# Altium schematic sheet 03-VS1053B.SchDoc: VS1053 and FM receiver
size A3; Date: 01/01/2016; Author: Frédéric Renet; Organization: APTUSTECH; Address2: 8 Rue Esperandieu; Address3: 13004 Marseille; Address4: FRANCE; DocumentNumber: 123; Revision: 1.0; SheetNumber: 4; SheetTotal: 6
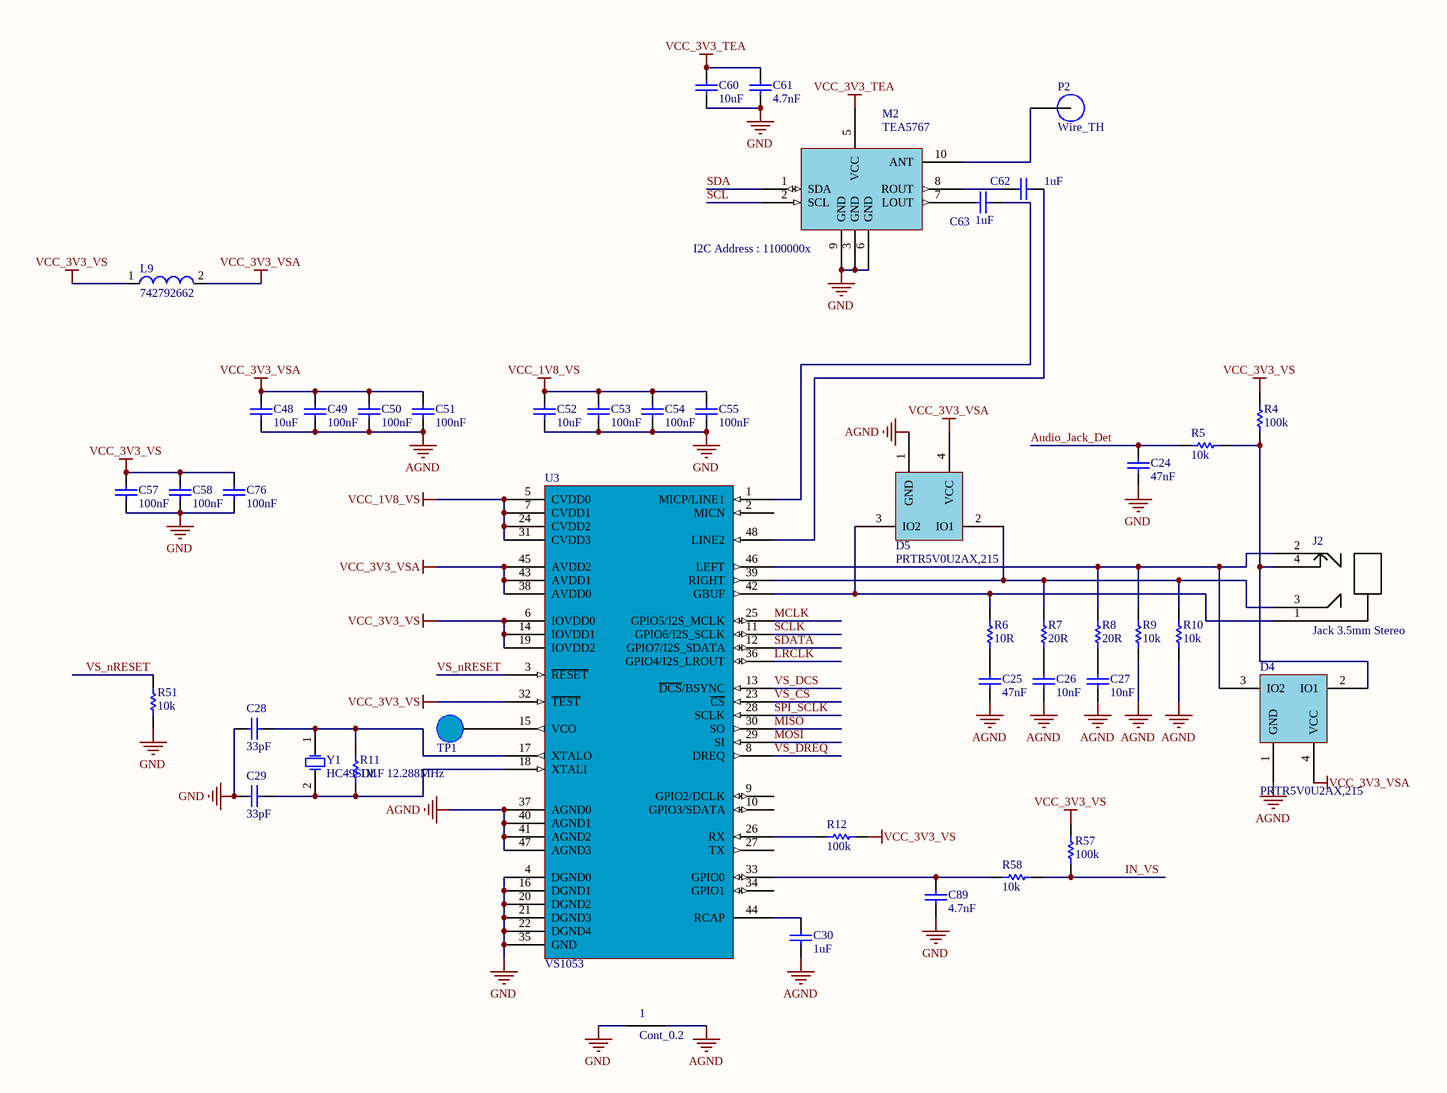
[diagram p0: 03-VS1053B.SchDoc]

## Parts
1  Cont_0.2  [CONT_0.2]  (net tie, no BOM)
C24  value 47nF  [CAPC1608X06N]  (hidden comment: 47nF 50V 0603 X7R)
C25  value 47nF  [CAPC1608X06N]  (hidden comment: 47nF 50V 0603 X7R)
C26  value 10nF  [CAPC1608X06N]  (hidden comment: 10nF 50V 0603 NP0)
C27  value 10nF  [CAPC1608X06N]  (hidden comment: 10nF 50V 0603 NP0)
C28  value 33pF  [CAPC1608X06N]  (hidden comment: 33pF 50V 0603 NP0)
C29  value 33pF  [CAPC1608X06N]  (hidden comment: 33pF 50V 0603 NP0)
C30  value 1uF  [CAPC1608X06N]  (hidden comment: 1uF 16V 0603 X7R)
C48  value 10uF  [CAPC1608X06N]  (hidden comment: 10uF 6.3V 0603 X5R)
C49  value 100nF  [CAPC1608X06N]  (hidden comment: 100nF 25V 0603 X5R)
C50  value 100nF  [CAPC1608X06N]  (hidden comment: 100nF 25V 0603 X5R)
C51  value 100nF  [CAPC1608X06N]  (hidden comment: 100nF 25V 0603 X5R)
C52  value 10uF  [CAPC1608X06N]  (hidden comment: 10uF 6.3V 0603 X5R)
C53  value 100nF  [CAPC1608X06N]  (hidden comment: 100nF 25V 0603 X5R)
C54  value 100nF  [CAPC1608X06N]  (hidden comment: 100nF 25V 0603 X5R)
C55  value 100nF  [CAPC1608X06N]  (hidden comment: 100nF 25V 0603 X5R)
C57  value 100nF  [CAPC1608X06N]  (hidden comment: 100nF 25V 0603 X5R)
C58  value 100nF  [CAPC1608X06N]  (hidden comment: 100nF 25V 0603 X5R)
C60  value 10uF  [CAPC1608X06N]  (hidden comment: 10uF 6.3V 0603 X5R)
C61  value 4.7nF  [CAPC1608X06N]  (hidden comment: 4.7nF 50V 0603 X7R)
C62  value 1uF  [CAPC1608X06N]  (hidden comment: 1uF 16V 0603 X7R)
C63  value 1uF  [CAPC1608X06N]  (hidden comment: 1uF 16V 0603 X7R)
C76  value 100nF  [CAPC1608X06N]  (hidden comment: 100nF 25V 0603 X5R)
C89  value 4.7nF  [CAPC1608X06N]  (hidden comment: 4.7nF 50V 0603 X7R)
D4  PRTR5V0U2AX,215  [SOT190P230X120-4N]
D5  PRTR5V0U2AX,215  [SOT190P230X120-4N]
J2  Jack 3.5mm Stereo  [SJ1-352xng]
L9  742792662  [CAPC0603(1608)]
M2  TEA5767  [MOD_TEA5767]
P2  Wire_TH  [TH_0.8mm]  (no BOM)
R4  value 100k  [RESC1608X06N]  (hidden comment: 100k_0603)
R5  value 10k  [RESC1608X06N]  (hidden comment: 10k_0603)
R6  value 10R  [RESC1608X06N]  (hidden comment: 10R_0603)
R7  value 20R  [RESC1608X06N]  (hidden comment: 20R_0603)
R8  value 20R  [RESC1608X06N]  (hidden comment: 20R_0603)
R9  value 10k  [RESC1608X06N]  (hidden comment: 10k_0603)
R10  value 10k  [RESC1608X06N]  (hidden comment: 10k_0603)
R11  value 1M  [RESC1608X06N]  (hidden comment: 1M_0603)
R12  value 100k  [RESC1608X06N]  (hidden comment: 100k_0603)
R51  value 10k  [RESC1608X06N]  (hidden comment: 10k_0603)
R57  value 100k  [RESC1608X06N]  (hidden comment: 100k_0603)
R58  value 10k  [RESC1608X06N]  (hidden comment: 10k_0603)
TP1  TP_1mm  [TP_1mm]  (value not drawn)  (no BOM)
U3  VS1053  [TSQFP50P900X900X160-48N]
Y1  HC49SDLF 12.288MHz  [TXC 9C]

## Nets
AGND: 1.2 C25.1 C26.1 C27.1 C30.1 C48.1 C49.1 C50.1 C51.1 D4.1(GND) D5.1(GND) R9.2 R10.2 U3.37(AGND0) U3.40(AGND1) U3.41(AGND2) U3.47(AGND3)
GND: 1.1 C24.1 C28.1 C29.1 C52.1 C53.1 C54.1 C55.1 C57.1 C58.1 C60.1 C61.1 C76.1 C89.1 M2.3(GND) M2.6(GND) M2.9(GND) R51.1 U3.4(DGND0) U3.16(DGND1) U3.20(DGND2) U3.21(DGND3) U3.22(DGND4) U3.35(GND)
VCC_1V8_VS: C52.2 C53.2 C54.2 C55.2 U3.5(CVDD0) U3.7(CVDD1) U3.24(CVDD2) U3.31(CVDD3)
VCC_3V3_TEA: C60.2 C61.2 M2.5(VCC)
VCC_3V3_VS: C57.2 C58.2 C76.2 L9.1 R4.2 R12.2 R57.2 U3.6(IOVDD0) U3.14(IOVDD1) U3.19(IOVDD2) U3.32(~{TEST})
VCC_3V3_VSA: C48.2 C49.2 C50.2 C51.2 D4.4(VCC) D5.4(VCC) L9.2 U3.38(AVDD0) U3.43(AVDD1) U3.45(AVDD2)
Audio_Jack_Det: C24.2 R5.1
IN_VS: R57.1 R58.1
LRCLK: U3.36(GPIO4/I2S_LROUT)
MCLK: U3.25(GPIO5/I2S_MCLK)
MISO: U3.30(SO)
MOSI: U3.29(SI)
SCL: M2.2(SCL)
SCLK: U3.11(GPIO6/I2S_SCLK)
SDA: M2.1(SDA)
SDATA: U3.12(GPIO7/I2S_SDATA)
SPI_SCLK: U3.28(SCLK)
VS_CS: U3.23(~{CS})
VS_DCS: U3.13(~{DCS}/BSYNC)
VS_DREQ: U3.8(DREQ)
VS_nRESET: R51.2 U3.3(~{RESET})
NetC25_2: C25.2 R6.1
NetC26_2: C26.2 R7.1
NetC27_2: C27.2 R8.1
NetC28_2: C28.2 R11.2 U3.17(XTALO) Y1.1(OSC1)
NetC29_2: C29.2 R11.1 U3.18(XTALI) Y1.2(OSC2)
NetC30_2: C30.2 U3.44(RCAP)
NetC62_1: C62.1 M2.8(ROUT)
NetC62_2: C62.2 U3.48(LINE2)
NetC63_1: C63.1 M2.7(LOUT)
NetC63_2: C63.2 U3.1(MICP/LINE1)
NetC89_2: C89.2 R58.2 U3.33(GPIO0)
NetD4_2: D4.2(IO1) J2.4 R4.1 R5.2
NetD4_3: D4.3(IO2) J2.2 R8.2 R9.1 U3.46(LEFT)
NetD5_2: D5.2(IO1) J2.3 R7.2 R10.1 U3.39(RIGHT)
NetD5_3: D5.3(IO2) J2.1 R6.2 U3.42(GBUF)
NetM2_10: M2.10(ANT) P2.1
NetR12_1: R12.1 U3.26(RX)
NetTP1_1: TP1.1 U3.15(VCO)

Not connected (* = marked no-connect by the designer): U3 2(MICN) 9(GPIO2/DCLK) 10(GPIO3/SDATA) 27(TX) 34(GPIO1)

## Notes on the sheet
- (near M2) I2C Address : 1100000x
- Title
- Size:
- Date:
- A3
- Number:
- Author:
- Revision:
- Sheet
- of
- File:

## Library data of the parts
1 = Cont_0.2: Split Net Name 0.2mm
C24 C25 = 47nF 50V 0603 X7R: Tolerance: 10%; Voltage: 50V; Supplier1: Digikey; Supplier2: Mouser; Supplier3: Farnell; RefSupplier1: 1276-1063-1-ND; RefSupplier2: *; RefSupplier3: *; Case: 0603; Material: X7R
C26 C27 = 10nF 50V 0603 NP0: Tolerance: 10%; Voltage: 50V; Supplier1: Digikey; Supplier2: Mouser; Supplier3: Farnell; RefSupplier1: 490-9666-1-ND; RefSupplier2: *; RefSupplier3: *; Case: 0603; Material: NP0
C28 C29 = 33pF 50V 0603 NP0: Tolerance: 10%; Voltage: 50V; Supplier1: Digikey; Supplier2: Mouser; Supplier3: Farnell; RefSupplier1: 490-1415-1-ND; RefSupplier2: *; RefSupplier3: *; Case: 0603; Material: NP0
C30 C62 C63 = 1uF 16V 0603 X7R: Tolerance: 10%; Voltage: 16V; Supplier1: Digikey; Supplier2: Mouser; Supplier3: Farnell; RefSupplier1: EMK107B7105KA-T; RefSupplier2: *; RefSupplier3: *; Case: 0603; Material: X7R
C48 C52 C60 = 10uF 6.3V 0603 X5R: Tolerance: 10%; Voltage: 6.3V; Supplier1: Digikey; Supplier2: Mouser; Supplier3: Farnell; RefSupplier1: 587-1256-1-ND; RefSupplier2: *; RefSupplier3: *; Case: 0603; Material: X5R
C49-C51 C53-C55 C57 C58 C76 = 100nF 25V 0603 X5R: Tolerance: 10%; Voltage: 25V; Supplier1: Digikey; Supplier2: Mouser; Supplier3: Farnell; RefSupplier1: 587-1245-1-ND; RefSupplier2: *; RefSupplier3: *; Case: 0603; Material: X5R
C61 C89 = 4.7nF 50V 0603 X7R: Tolerance: 10%; Voltage: 50V; Supplier1: Digikey; Supplier2: Mouser; Supplier3: Farnell; RefSupplier1: 490-12741-1-ND; RefSupplier2: *; RefSupplier3: *; Case: 0603; Material: X7R
D4 D5 = PRTR5V0U2AX,215: Ultra low capacitance double rail-to-rail ESD protection diode; Manufacturer: Nexperia; PartNumber: PRTR5V0U2AX,215; Case: SOT-143-B
J2 = SJ1-3524NG: SJ1-3524NG Jack 3.5mm Stereo; Manufacturer: CUI; PartNumber: SJ1-3524NG; Supplier1: Digikey; RefSupplier1: CP1-3524NG-ND
L9 = CMP-0220-00178-1: SMD EMI Suppression Ferrite Bead WE-CBF, Z = 1000 Ohm; Manufacturer: Wurth; PackageDescription: Chip Inductor, 2-Leads, Body 1.6 x 0.8 mm; PackageVersion: 2009; PackageReference: SMD-0603; ComponentLink1URL: http://www.we-online.com; ComponentLink2URL: http://www.we-online.de/katalog/media/pdf/742792662.pdf; Impedance: 1000 Ohm; DatasheetVersion: ver 1, Mar-2010; ComponentLink1Description: Manufacturer Link; ComponentLink2Description: Datasheet; RefManufacturer: 742792662
M2 = TEA5767: FM Receiver 11x11mm TEA5767; PartNumber: MODULE_TEA5767
P2 = Wire_TH: 0.8mm Hole
R4 R12 R57 = 100k: Resistor 100k 0603 1%; Case: 0603; Tolerance: 1%; Supplier1: Digikey; Supplier2: *; Supplier3: *; RefSupplier1: 311-100KHRCT-ND; RefSupplier2: *; RefSupplier3: *
R5 R9 R10 R51 R58 = 10k: Resistor 10k 0603 1%; Case: 0603; Tolerance: 1%; Size: 0603, 1.6x0.8x0.8mm; RefSupplier1: 311-10.0KHRCT-ND; RefSupplier2: *; RefSupplier3: *; Supplier1: Digikey; Supplier2: *; Supplier3: *
R6 = 10R: Resistor 10R 0603 1%; Case: 0603; Tolerance: 1%; Size: 0603, 1.6x0.8x0.8mm; RefSupplier1: 311-10.0HRCT-ND; RefSupplier2: *; RefSupplier3: *; Supplier1: Digikey; Supplier2: *; Supplier3: *
R7 R8 = 20R: Resistor 20R 0603 1%; Case: 0603; Tolerance: 1%; Size: 0603, 1.6x0.8x0.8mm; RefSupplier1: 311-20.0HRCT-ND; RefSupplier2: *; RefSupplier3: *; Supplier1: Digikey; Supplier2: *; Supplier3: *
R11 = 1M: Resistor 1M 0603 1%; Case: 0603; Tolerance: 1%; Size: 0603, 1.6x0.8x0.8mm; Supplier1: Digikey; Supplier2: Mouser; Supplier3: Farnell; RefSupplier1: 311-1.00MHRCT-ND; RefSupplier2: *; RefSupplier3: *
TP1 = TP_1mm: Test point 1mm round SMD
U3 = VS1053: VS1053 DSP; PartNumber: VS1053b; Manufacturer: VLSI; Case: TQFP48
Y1 = HC49SDLF 12.288MHz: 12.2880MHz Crystal HC49 SMT 50ppm; PartNumber: FOXSDLF/128-20; Manufacturer: Fox Electronic; Value: 12.2880MHz; Tolerance: 50ppm; Case: HC49S